# EAGLE design RoPi 2560 0_3 (EAGLE 6.5.0)
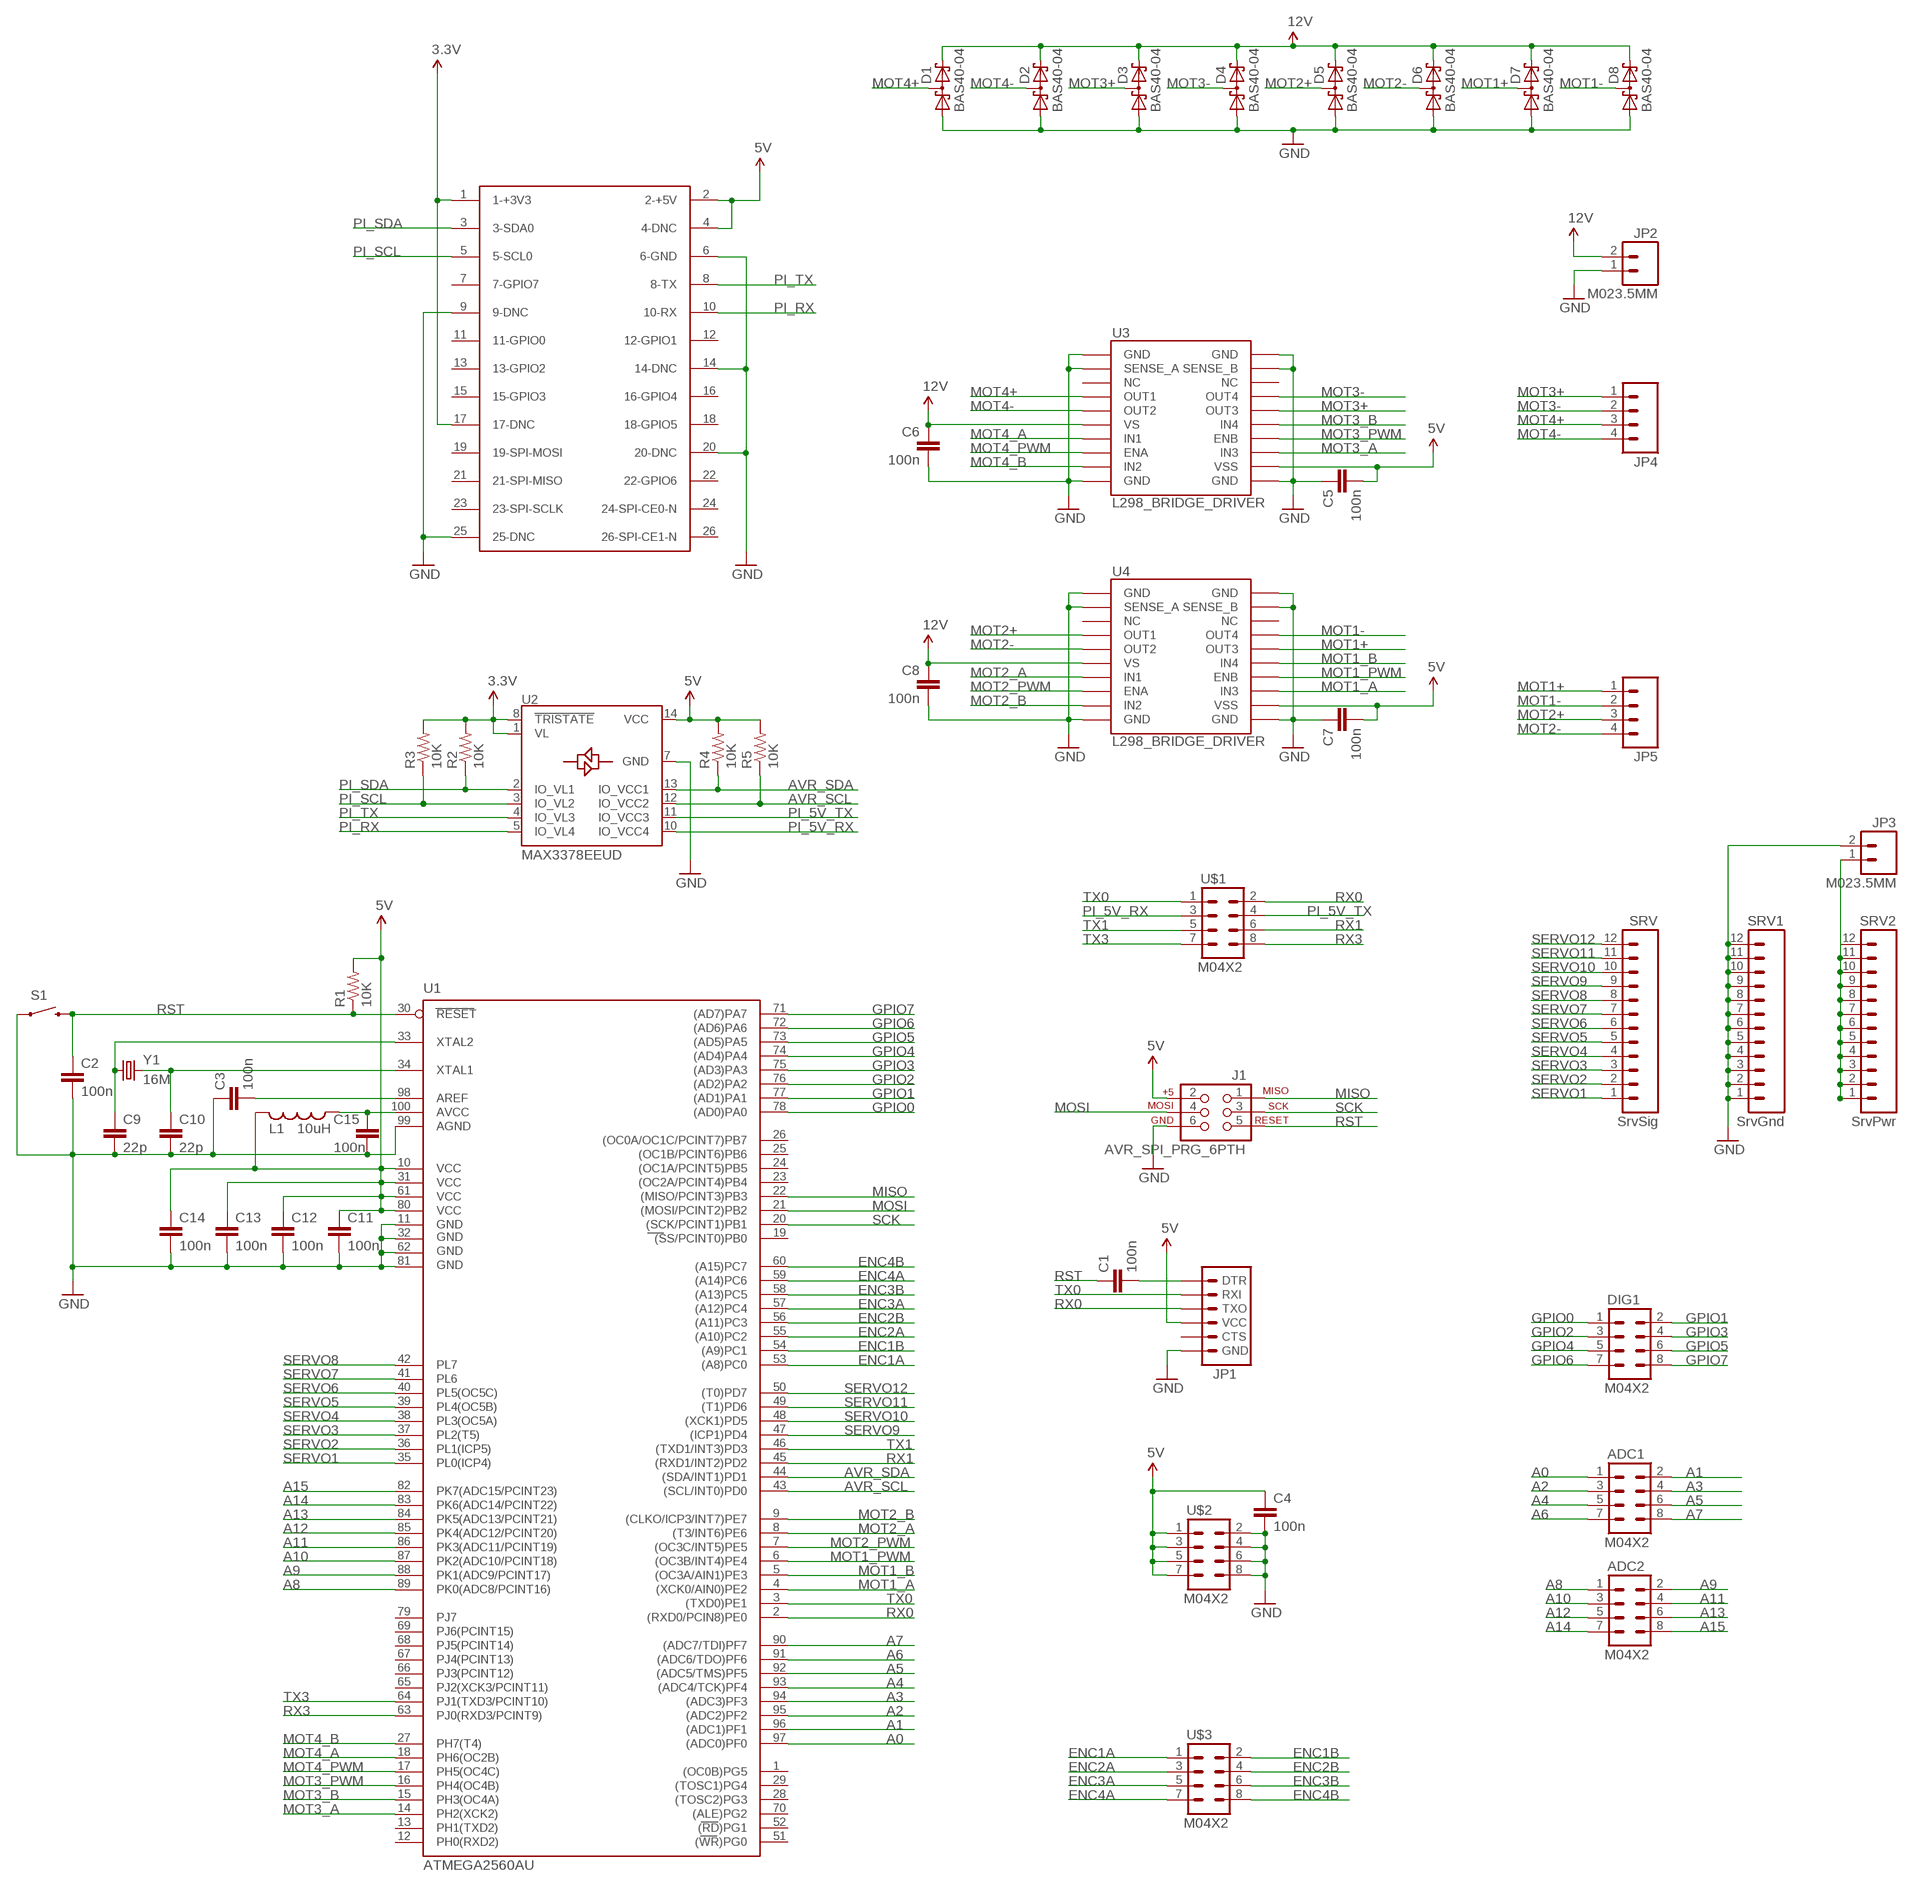
[diagram p0: schematic, sheet 1]

## Parts
ADC1  M04X2  [2X4]
ADC2  M04X2  [2X4]
C1  100n  CAP0603-CAP  [0603-CAP]
C2  100n  CAP0603-CAP  [0603-CAP]
C3  100n  CAP0603-CAP  [0603-CAP]
C4  100n  CAP0603-CAP  [0603-CAP]
C5  100n  CAP0603-CAP  [0603-CAP]
C6  100n  CAP0603-CAP  [0603-CAP]
C7  100n  CAP0603-CAP  [0603-CAP]
C8  100n  CAP0603-CAP  [0603-CAP]
C9  22p  CAP0603-CAP  [0603-CAP]
C10  22p  CAP0603-CAP  [0603-CAP]
C11  100n  CAP0603-CAP  [0603-CAP]
C12  100n  CAP0603-CAP  [0603-CAP]
C13  100n  CAP0603-CAP  [0603-CAP]
C14  100n  CAP0603-CAP  [0603-CAP]
C15  100n  CAP0603-CAP  [0603-CAP]
D1  BAS40-04  [SOT23]
D2  BAS40-04  [SOT23]
D3  BAS40-04  [SOT23]
D4  BAS40-04  [SOT23]
D5  BAS40-04  [SOT23]
D6  BAS40-04  [SOT23]
D7  BAS40-04  [SOT23]
D8  BAS40-04  [SOT23]
DIG1  M04X2  [2X4]
J1  AVR_SPI_PRG_6PTH  [2X3]
JP1  ARDUINO_SERIAL_PROGRAMSMD  [1X06-SMD]
JP2  M023.5MM  [SCREWTERMINAL-3.5MM-2]
JP3  M023.5MM  [SCREWTERMINAL-3.5MM-2]
JP4  M04SCREW  [SCREWTERMINAL-3.5MM-4]
JP5  M04SCREW  [SCREWTERMINAL-3.5MM-4]
L1  10uH  L-US  [R0603]
PI  RASPBERRY-PI  [RASPBERRY-PI]
R1  10K  RESISTOR0603-RES  [0603-RES]
R2  10K  RESISTOR0603-RES  [0603-RES]
R3  10K  RESISTOR0603-RES  [0603-RES]
R4  10K  RESISTOR0603-RES  [0603-RES]
R5  10K  RESISTOR0603-RES  [0603-RES]
S1  SWITCH-MOMENTARY-2SMD-4  [TACTILE_SWITCH_TALL]
SRV  SrvSig  M12PTH  [1X12]
SRV1  SrvGnd  M12PTH  [1X12]
SRV2  SrvPwr  M12PTH  [1X12]
U1  ATMEGA2560AU  [TQFP100]
U2  MAX3378EEUD  [TSSOP14]
U3  L298_BRIDGE_DRIVER  [POWERSO20]
U4  L298_BRIDGE_DRIVER  [POWERSO20]
U$1  M04X2  [2X4]
U$2  M04X2  [2X4]
U$3  M04X2  [2X4]
Y1  16M  CRYSTALSMD  [HC49UP]

## Nets
3.3V: PI.1(1-+3V3) PI.17(17-DNC) R2.2 R3.2 U2.1(VL) U2.8(!TRISTATE)
5V: C4.1 C5.2 C7.2 C11.1 C12.1 C13.1 C14.1 J1.2 JP1.4(VCC) L1.2 PI.2(2-+5V) PI.4(4-DNC) R1.2 R4.2 R5.2 U1.10(VCC) U1.31(VCC1) U1.61(VCC2) U1.80(VCC3) U2.14(VCC) U3.12(VSS) U4.12(VSS) U$2.1 U$2.3 U$2.5 U$2.7
A0: ADC1.1 U1.97((ADC0)PF0)
A1: ADC1.2 U1.96((ADC1)PF1)
A2: ADC1.3 U1.95((ADC2)PF2)
A3: ADC1.4 U1.94((ADC3)PF3)
A4: ADC1.5 U1.93((ADC4/TCK)PF4)
A5: ADC1.6 U1.92((ADC5/TMS)PF5)
A6: ADC1.7 U1.91((ADC6/TDO)PF6)
A7: ADC1.8 U1.90((ADC7/TDI)PF7)
A8: ADC2.1 U1.89(PK0(ADC8/PCINT16))
A9: ADC2.2 U1.88(PK1(ADC9/PCINT17))
A10: ADC2.3 U1.87(PK2(ADC10/PCINT18))
A11: ADC2.4 U1.86(PK3(ADC11/PCINT19))
A12: ADC2.5 U1.85(PK4(ADC12/PCINT20))
A13: ADC2.6 U1.84(PK5(ADC13/PCINT21))
A14: ADC2.7 U1.83(PK6(ADC14/PCINT22))
A15: ADC2.8 U1.82(PK7(ADC15/PCINT23))
AREF: C3.2 U1.98(AREF)
AVR_SCL: R5.1 U1.43((SCL/INT0)PD0) U2.12(IO_VCC2)
AVR_SDA: R4.1 U1.44((SDA/INT1)PD1) U2.13(IO_VCC1)
DTR: C1.2 JP1.1(DTR)
ENC1A: U1.53((A8)PC0) U$3.1
ENC1B: U1.54((A9)PC1) U$3.2
ENC2A: U1.55((A10)PC2) U$3.3
ENC2B: U1.56((A11)PC3) U$3.4
ENC3A: U1.57((A12)PC4) U$3.5
ENC3B: U1.58((A13)PC5) U$3.6
ENC4A: U1.59((A14)PC6) U$3.7
ENC4B: U1.60((A15)PC7) U$3.8
GND: C2.2 C3.1 C4.2 C5.1 C6.2 C7.1 C8.2 C9.2 C10.2 C11.2 C12.2 C13.2 C14.2 C15.2 D1.1(A1) D2.1(A1) D3.1(A1) D4.1(A1) D5.1(A1) D6.1(A1) D7.1(A1) D8.1(A1) J1.6 JP1.6(GND) JP2.1 JP3.2 PI.6(6-GND) PI.9(9-DNC) PI.14(14-DNC) PI.20(20-DNC) PI.25(25-DNC) S1.A2 SRV1.1 SRV1.2 SRV1.3 SRV1.4 SRV1.5 SRV1.6 SRV1.7 SRV1.8 SRV1.9 SRV1.10 SRV1.11 SRV1.12 U1.11(GND) U1.32(GND1) U1.62(GND2) U1.81(GND3) U1.99(AGND) U2.7(GND) U3.1(GND) U3.2(SENSE_A) U3.10(GND) U3.11(GND) U3.19(SENSE_B) U3.20(GND) U4.1(GND) U4.2(SENSE_A) U4.10(GND) U4.11(GND) U4.19(SENSE_B) U4.20(GND) U$2.2 U$2.4 U$2.6 U$2.8
GPIO0: DIG1.1 U1.78((AD0)PA0)
GPIO1: DIG1.2 U1.77((AD1)PA1)
GPIO2: DIG1.3 U1.76((AD2)PA2)
GPIO3: DIG1.4 U1.75((AD3)PA3)
GPIO4: DIG1.5 U1.74((AD4)PA4)
GPIO5: DIG1.6 U1.73((AD5)PA5)
GPIO6: DIG1.7 U1.72((AD6)PA6)
GPIO7: DIG1.8 U1.71((AD7)PA7)
MISO: J1.1 U1.22((MISO/PCINT3)PB3)
MOSI: J1.4 U1.21((MOSI/PCINT2)PB2)
MOT1+: D7.3(C1A2) JP5.1 U4.16(OUT3)
MOT1-: D8.3(C1A2) JP5.2 U4.17(OUT4)
MOT1_A: U1.4((XCK0/AIN0)PE2) U4.13(IN3)
MOT1_B: U1.5((OC3A/AIN1)PE3) U4.15(IN4)
MOT1_PWM: U1.6((OC3B/INT4)PE4) U4.14(ENB)
MOT2+: D5.3(C1A2) JP5.3 U4.4(OUT1)
MOT2-: D6.3(C1A2) JP5.4 U4.5(OUT2)
MOT2_A: U1.8((T3/INT6)PE6) U4.7(IN1)
MOT2_B: U1.9((CLKO/ICP3/INT7)PE7) U4.9(IN2)
MOT2_PWM: U1.7((OC3C/INT5)PE5) U4.8(ENA)
MOT3+: D3.3(C1A2) JP4.1 U3.16(OUT3)
MOT3-: D4.3(C1A2) JP4.2 U3.17(OUT4)
MOT3_A: U1.14(PH2(XCK2)) U3.13(IN3)
MOT3_B: U1.15(PH3(OC4A)) U3.15(IN4)
MOT3_PWM: U1.16(PH4(OC4B)) U3.14(ENB)
MOT4+: D1.3(C1A2) JP4.3 U3.4(OUT1)
MOT4-: D2.3(C1A2) JP4.4 U3.5(OUT2)
MOT4_A: U1.18(PH6(OC2B)) U3.7(IN1)
MOT4_B: U1.27(PH7(T4)) U3.9(IN2)
MOT4_PWM: U1.17(PH5(OC4C)) U3.8(ENA)
N$1: JP3.1 SRV2.1 SRV2.2 SRV2.3 SRV2.4 SRV2.5 SRV2.6 SRV2.7 SRV2.8 SRV2.9 SRV2.10 SRV2.11 SRV2.12
N$2: C15.1 L1.1 U1.100(AVCC)
PI_5V_RX: U2.10(IO_VCC4) U$1.3
PI_5V_TX: U2.11(IO_VCC3) U$1.4
PI_RX: PI.10(10-RX) U2.5(IO_VL4)
PI_SCL: PI.5(5-SCL0) R3.1 U2.3(IO_VL2)
PI_SDA: PI.3(3-SDA0) R2.1 U2.2(IO_VL1)
PI_TX: PI.8(8-TX) U2.4(IO_VL3)
RST: C1.1 C2.1 J1.5 R1.1 S1.B2 U1.30(RESET)
RX0: JP1.3(TXO) U1.2((RXD0/PCIN8)PE0) U$1.2
RX1: U1.45((RXD1/INT2)PD2) U$1.6
RX3: U1.63(PJ0(RXD3/PCINT9)) U$1.8
SCK: J1.3 U1.20((SCK/PCINT1)PB1)
SERVO1: SRV.1 U1.35(PL0(ICP4))
SERVO2: SRV.2 U1.36(PL1(ICP5))
SERVO3: SRV.3 U1.37(PL2(T5))
SERVO4: SRV.4 U1.38(PL3(OC5A))
SERVO5: SRV.5 U1.39(PL4(OC5B))
SERVO6: SRV.6 U1.40(PL5(OC5C))
SERVO7: SRV.7 U1.41(PL6)
SERVO8: SRV.8 U1.42(PL7)
SERVO9: SRV.9 U1.47((ICP1)PD4)
SERVO10: SRV.10 U1.48((XCK1)PD5)
SERVO11: SRV.11 U1.49((T1)PD6)
SERVO12: SRV.12 U1.50((T0)PD7)
TX0: JP1.2(RXI) U1.3((TXD0)PE1) U$1.1
TX1: U1.46((TXD1/INT3)PD3) U$1.5
TX3: U1.64(PJ1(TXD3/PCINT10)) U$1.7
V_BATT: C6.1 C8.1 D1.2(C2) D2.2(C2) D3.2(C2) D4.2(C2) D5.2(C2) D6.2(C2) D7.2(C2) D8.2(C2) JP2.2 U3.6(VS) U4.6(VS) ; supply symbol labelled 12V
XTAL1: C10.1 U1.34(XTAL1) Y1.2
XTAL2: C9.1 U1.33(XTAL2) Y1.1
Unconnected: JP1.5(CTS) PI.7(7-GPIO7) PI.11(11-GPIO0) PI.12(12-GPIO1) PI.13(13-GPIO2) PI.15(15-GPIO3) PI.16(16-GPIO4) PI.18(18-GPIO5) PI.19(19-SPI-MOSI) PI.21(21-SPI-MISO) PI.22(22-GPIO6) PI.23(23-SPI-SCLK) PI.24(24-SPI-CE0-N) PI.26(26-SPI-CE1-N) U1.1((OC0B)PG5) U1.12(PH0(RXD2)) U1.13(PH1(TXD2)) U1.19((SS/PCINT0)PB0) U1.23((OC2A/PCINT4)PB4) U1.24((OC1A/PCINT5)PB5) U1.25((OC1B/PCINT6)PB6) U1.26((OC0A/OC1C/PCINT7)PB7) U1.28((TOSC2)PG3) U1.29((TOSC1)PG4) U1.51((WR)PG0) U1.52((RD)PG1) U1.65(PJ2(XCK3/PCINT11)) U1.66(PJ3(PCINT12)) U1.67(PJ4(PCINT13)) U1.68(PJ5(PCINT14)) U1.69(PJ6(PCINT15)) U1.70((ALE)PG2) U1.79(PJ7) U3.3(NC) U3.18(NC) U4.3(NC) U4.18(NC)

## Library data of the parts
ADC1 ADC2 DIG1 U$1-U$3 = SparkFun-Connectors:M04X2: .1" header, two rows of four.
C1-C15 = SparkFun-Passives:CAP: Capacitor Standard 0603 ceramic capacitor, and 0.1" leaded capacitor.
D1-D8 = diode:BAS40-04: Silicon Schottky Diodes General-purpose diode for high-speed switching
J1 = SparkFun-Connectors:AVR_SPI_PRG_6: AVR ISP 6 Pin This is the reduced ISP connector for AVR programming. Common on Arduino. This footprint will take up less PCB space and can be used with a 10-pin to 6-pin adapter such as SKU: BOB-08508
JP1 = SparkFun-Connectors:ARDUINO_SERIAL_PROGRAM: FTDI connector footprints
JP2 JP3 = SparkFun-Connectors:M02: Standard 2-pin 0.1" header. Use with - straight break away headers ( PRT-00116) - right angle break away headers (PRT-00553) - swiss pins (PRT-00743) - machine pins (PRT-00117) - female headers (PRT-00115) Molex polarized connector foot print use with: PRT-08233 with associated crimp pins and housings. 2.54_SCREWTERM for use with PRT-10571. 3.5mm Screw Terminal footprints for PRT-08084 5mm Screw Terminal footprints for use with PRT-08433
JP4 JP5 = SparkFun-Connectors:M04: Header 4 Standard 4-pin 0.1" header. Use with straight break away headers (SKU : PRT-00116), right angle break away headers (PRT-00553), swiss pins (PRT-00743), machine pins (PRT-00117), and female headers (PRT-00115). Molex polarized connector foot print use with SKU : PRT-08231 with associated crimp pins and housings. 1MM SMD Version SKU: PRT-10208
L1 = dab5267:L-US: INDUCTOR, American symbol
PI = RaspberryPi:RASPBERRY-PI: Raspberry Pi Board <http://www.raspberrypi.org/> Jacques Lagnel V1.0 (beta) 2012 Board dimension: Forum 3D model <http://www.raspberrypi.org/forum/general-discussion/mechanical-profile-3d-models?value=3d%20model&type=1&include=1&search=1&ret=all> The GPIO Connector (P1): http://elinux.org/RPi_Low-level_peripherals
R1-R5 = SparkFun-Passives:RESISTOR: Resistor Basic schematic elements and footprints for 0603, 1206, and PTH resistors.
S1 = SparkFun-Electromechanical:SWITCH-MOMENTARY-2: Various NO switches- pushbuttons, reed, etc
SRV SRV1 SRV2 = SparkFun-Connectors:M12: Header 12 Standard 12-pin 0.1" header. Use with straight break away headers (SKU : PRT-00116), right angle break away headers (PRT-00553), swiss pins (PRT-00743), machine pins (PRT-00117), and female headers (PRT-00115).
U1 = SparkFun-DigitalIC:ATMEGA2560: Atmel 100-pin 8-bit uC 64/128/256 Kbytes FLASH 4 Kbytes EEPROM 8 Kbytes SRAM 86 General Purpose I/O pins 12-channels16-bit PWM 4 x Serial USARTs 16-channels 10-bit A/D
U2 = max3378e:MAX3378EEUD: ±15kV ESD-Protected, 1µA, 16Mbps, Dual/Quad Low-Voltage Level Translators in UCSP
U3 U4 = SparkFun-PowerIC:L298_BRIDGE_DRIVER: Full-bridge power driver IC
Y1 = SparkFun-FreqCtrl:CRYSTAL: Various standard crystals. Proven footprints. Spark Fun Electronics SKU : COM-00534

## Board
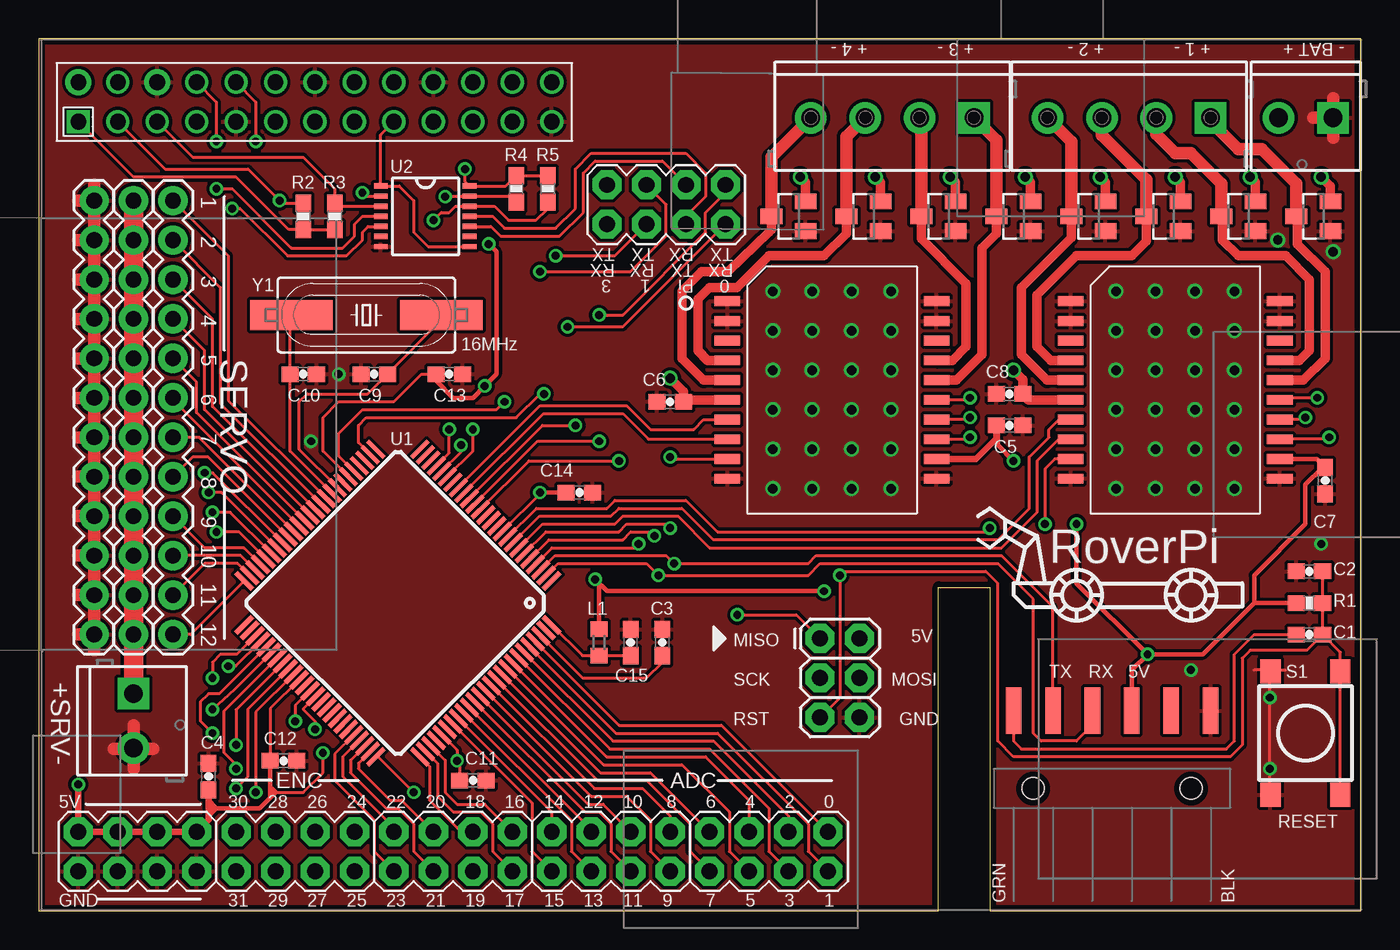
[diagram p1: board, top side]
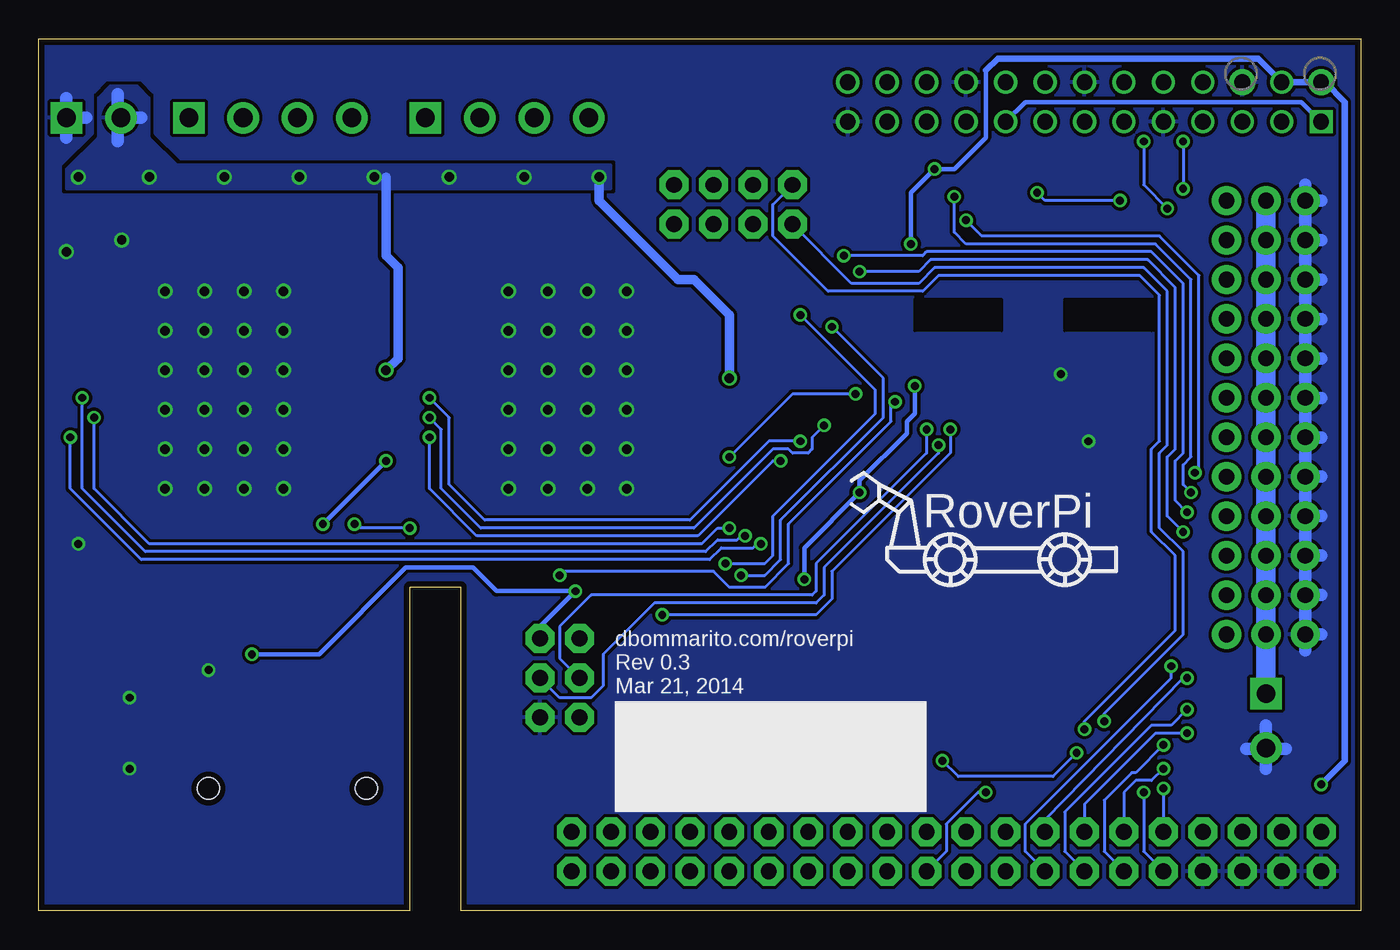
[diagram p2: board, bottom side, seen from below]

Size 85.09 x 56.13 mm. Coordinates in mm from the lower left corner, seen from the top.
Outline: 0,0 57.91,0 57.91,20.83 61.21,20.83 61.21,0 85.09,0 85.09,56.13 0,56.13 0,0
Copper layers (1*16): Top 0.0356mm / dielectric 1.5011mm / Bottom 0.0356mm
Design rules "OSHPark *": minimum track width 6mil, minimum drill 13mil, track to track 8mil, track to pad 8mil, pad to pad 8mil, via to via 8mil, smd to smd 8mil, copper to edge 15mil, drill to drill 6mil, minimum pad ring 7mil, minimum via ring 7mil, stop-mask expansion 3mil, vias tented up to drill 30mil, thermal gap 8mil

### Footprints (pad centres in the part's own frame; a part is rotated, then mirrored left to right if it is on the bottom)
2X4 = drill 1.016 pad 1.88 octagon: 1 -3.81,-1.27; 2 -3.81,1.27; 3 -1.27,-1.27; 4 -1.27,1.27; 5 1.27,-1.27; 6 1.27,1.27; 7 3.81,-1.27; 8 3.81,1.27
0603-CAP = smd 1.1 x 1: 1 -0.85,0; 2 0.85,0
SOT23 = smd 1 x 1.4: 1 -0.95,-1.1; 2 0.95,-1.1; 3 0,1.1
2X3 = drill 1.016 pad 1.88 octagon: 1 0,0; 2 0,2.54; 3 2.54,0; 4 2.54,2.54; 5 5.08,0; 6 5.08,2.54
1X06-SMD = smd 1 x 3: 1 -6.35,5; 2 -3.81,5; 3 -1.27,5; 4 1.27,5; 5 3.81,5; 6 6.35,5 | hole 1.4: -5.08,0; 5.08,0
SCREWTERMINAL-3.5MM-2 = drill 1.2 pad 2.032 square: 1 0,0 | drill 1.2 pad 2.032: 2 3.5,0
SCREWTERMINAL-3.5MM-4 = drill 1.2 pad 2.032 square: 1 0,0 | drill 1.2 pad 2.032: 2 3.5,0; 3 7,0; 4 10.5,0
R0603 = smd 1 x 1.1: 1 -0.85,0; 2 0.85,0
RASPBERRY-PI = drill 1 square: 1 0,0 | drill 1 pad 1.676: 2 0,2.54; 6 5.08,2.54 | drill 1: 3 2.54,0; 4 2.54,2.54; 5 5.08,0; 7 7.62,0; 8 7.62,2.54; 9 10.16,0; 10 10.16,2.54; 11 12.7,0; 12 12.7,2.54; 13 15.24,0; 14 15.24,2.54; 15 17.78,0; 16 17.78,2.54; 17 20.32,0; 18 20.32,2.54; 19 22.86,0; 20 22.86,2.54; 21 25.4,0; 22 25.4,2.54; 23 27.94,0; 24 27.94,2.54; 25 30.48,0; 26 30.48,2.54
0603-RES = smd 1.1 x 1: 1 -0.85,0; 2 0.85,0
TACTILE_SWITCH_TALL = smd 1.55 x 1.3: A1 -3.975,-2.25; A2 3.975,-2.25; B1 -3.975,2.25; B2 3.975,2.25
1X12 = drill 1.016 pad 1.88: 1 0,0; 2 2.54,0; 3 5.08,0; 4 7.62,0; 5 10.16,0; 6 12.7,0; 7 15.24,0; 8 17.78,0; 9 20.32,0; 10 22.86,0; 11 25.4,0; 12 27.94,0
TQFP100 = smd 1.5 x 0.3: 1 -8,6; 2 -8,5.5; 3 -8,5; 4 -8,4.5; 5 -8,4; 6 -8,3.5; 7 -8,3; 8 -8,2.5; 9 -8,2; 10 -8,1.5; 11 -8,1; 12 -8,0.5; 13 -8,0; 14 -8,-0.5; 15 -8,-1; 16 -8,-1.5; 17 -8,-2; 18 -8,-2.5; 19 -8,-3; 20 -8,-3.5; 21 -8,-4; 22 -8,-4.5; 23 -8,-5; 24 -8,-5.5; 25 -8,-6; 51 8,-6; 52 8,-5.5; 53 8,-5; 54 8,-4.5; 55 8,-4; 56 8,-3.5; 57 8,-3; 58 8,-2.5; 59 8,-2; 60 8,-1.5; 61 8,-1; 62 8,-0.5; 63 8,0; 64 8,0.5; 65 8,1; 66 8,1.5; 67 8,2; 68 8,2.5; 69 8,3; 70 8,3.5; 71 8,4; 72 8,4.5; 73 8,5; 74 8,5.5; 75 8,6 | smd 0.3 x 1.5: 26 -6,-8; 27 -5.5,-8; 28 -5,-8; 29 -4.5,-8; 30 -4,-8; 31 -3.5,-8; 32 -3,-8; 33 -2.5,-8; 34 -2,-8; 35 -1.5,-8; 36 -1,-8; 37 -0.5,-8; 38 0,-8; 39 0.5,-8; 40 1,-8; 41 1.5,-8; 42 2,-8; 43 2.5,-8; 44 3,-8; 45 3.5,-8; 46 4,-8; 47 4.5,-8; 48 5,-8; 49 5.5,-8; 50 6,-8; 76 6,8; 77 5.5,8; 78 5,8; 79 4.5,8; 80 4,8; 81 3.5,8; 82 3,8; 83 2.5,8; 84 2,8; 85 1.5,8; 86 1,8; 87 0.5,8; 88 0,8; 89 -0.5,8; 90 -1,8; 91 -1.5,8; 92 -2,8; 93 -2.5,8; 94 -3,8; 95 -3.5,8; 96 -4,8; 97 -4.5,8; 98 -5,8; 99 -5.5,8; 100 -6,8
TSSOP14 = smd 0.9 x 0.35: 1 -2.875,1.95; 2 -2.875,1.3; 3 -2.875,0.65; 4 -2.875,0; 5 -2.875,-0.65; 6 -2.875,-1.3; 7 -2.875,-1.95; 8 2.825,-1.95; 9 2.825,-1.3; 10 2.825,-0.65; 11 2.825,0; 12 2.825,0.65; 13 2.825,1.3; 14 2.825,1.95
POWERSO20 = smd 1.651 x 0.635: 1 -6.731,5.715; 2 -6.731,4.445; 3 -6.731,3.175; 4 -6.731,1.905; 5 -6.731,0.635; 6 -6.731,-0.635; 7 -6.731,-1.905; 8 -6.731,-3.175; 9 -6.731,-4.445; 10 -6.731,-5.715; 11 6.731,-5.715; 12 6.731,-4.445; 13 6.731,-3.175; 14 6.731,-1.905; 15 6.731,-0.635; 16 6.731,0.635; 17 6.731,1.905; 18 6.731,3.175; 19 6.731,4.445; 20 6.731,5.715
HC49UP = smd 5.334 x 1.93: 1 -4.826,0; 2 4.826,0

### Placement (x,y rotation side)
ADC1  46.99,3.81 180 top
ADC2  36.83,3.81 180 top
C1  81.79,17.78 180 top
C2  81.79,21.84 180 top
C3  40.13,17.27 270 top
C4  10.92,8.64 90 top
C5  62.48,31.24 180 top
C6  40.64,32.77 180 top
C7  82.8,27.69 90 top
C8  62.48,33.27 180 top
C9  21.59,34.54 180 top
C10  17.02,34.54 0 top
C11  27.94,8.38 0 top
C12  15.75,9.65 0 top
C13  26.42,34.54 0 top
C14  34.8,26.92 0 top
C15  38.1,17.27 90 top
D1  53.09,44.7 90 top
D2  48.26,44.7 90 top
D3  62.74,44.7 90 top
D4  57.91,44.7 90 top
D5  72.39,44.7 90 top
D6  67.56,44.7 90 top
D7  82.04,44.7 90 top
D8  77.22,44.7 90 top
DIG1  26.67,3.81 180 top
J1  50.29,17.53 270 top
JP1  69.09,7.87 0 top
JP2  83.31,51.05 180 top
JP3  6.1,13.97 270 top
JP4  60.2,51.05 180 top
JP5  75.44,51.05 180 top
L1  36.07,17.27 90 top
PI  2.54,50.8 0 top
R1  81.79,19.81 180 top
R2  17.02,44.7 270 top
R3  19.05,44.7 270 top
R4  30.73,46.48 90 top
R5  32.77,46.48 90 top
S1  81.53,11.43 270 top
SRV  8.64,45.72 270 top
SRV1  3.56,45.72 270 top
SRV2  6.1,45.72 270 top
U1  23.11,19.81 225 top
U2  24.89,44.7 0 top
U3  51.05,33.53 0 top
U4  73.15,33.53 0 top
U$1  40.39,45.47 180 top
U$2  6.35,3.81 180 top
U$3  16.51,3.81 180 top
Y1  21.08,38.35 180 top

### Tracks (layer width: path | path; a pad name or v marks a point on that pad's centre or on a via)
3.3V
  Top 0.203: PI.17 22.02,49.96 U2.1 23.2,46.65 24.13,45.72 24.13,43.69 25.06,42.75 U2.8 | PI.1 6.1,47.24 12.7,47.24 16.09,43.85 R2.2 R3.2
  Bottom 0.305: PI.1 3.81,52.07 21.59,52.07 PI.17
5V  (via drill 0.51)
  Top 0.203: U1.61 14.9,13.01 C12.1 | U1.31 18.29,29.59 18.29,31.75 19.3,32.77 22.86,32.77 24.64,34.54 C13.1 | U1.80 26.92,10.35 v26.92,9.65 27.09,9.49 C11.1 | U1.10 32.35,26.92 32.77,26.92 | R5.2 R4.2 30.06,46.65 U2.14 27.43,46.94 v27.43,47.75 | 15.24,7.62 17.02,7.62 18.29,8.89 v18.29,10.16
  Top 0.305: C12.1 14.9,7.28 | 14.9,7.28 14.22,6.6 11.43,6.6 | 11.43,6.6 10.92,6.1 | JP1.4 70.36,15.49 v71.37,16.51 | v71.37,16.51 74.93,16.51 78.23,19.81 | 78.23,19.81 R1.2 | 78.23,19.81 78.23,21.59 81.53,24.89 81.53,27.43 82.64,28.54 | U4.12 82.26,29.08 C7.2 | 10.92,6.6 11.43,6.6 | 11.43,6.6 10.92,7.11 | v28.96,42.93 29.46,42.42 29.46,34.54 v28.7,33.78 27.94,33.02 26.67,33.02 25.57,34.12 C13.1 | v32.26,26.92 32.77,26.92 C14.1 | L1.2 36.07,21.08 v35.81,21.34 36.58,20.57 v50.55,20.57 | v71.37,16.51 66.8,21.08 v66.8,24.89 | v62.74,28.96 61.72,29.97 61.72,31.15 C5.2 | 14.9,7.28 15.24,7.62 | 15.24,7.62 14.99,7.87 | 14.99,7.62 15.24,7.62
  Top 0.406: 10.67,7.71 C4.1 10.92,7.11 10.92,6.6 10.92,6.1 10.92,5.84 U$2.1 U$2.3 U$2.5 U$2.7 v2.54,8.13 | U3.12 60.33,29.08 61.63,30.39 C5.2 | C7.2 82.64,28.54
  Bottom 0.203: v18.29,10.16 19.81,8.64 25.91,8.64 v26.92,9.65
  Bottom 0.305: 24.13,54.1 24.13,49.78 26.16,47.75 v27.43,47.75 28.96,46.23 v28.96,42.93 | v28.7,33.78 28.7,32 29.21,31.5 29.21,30.73 32.26,27.69 v32.26,26.92 35.81,23.37 v35.81,21.34 | J1.2 52.83,18.29 v50.55,20.57 55.63,20.57 57.15,22.1 61.47,22.1 67.06,16.51 v71.37,16.51 | v66.8,24.89 v62.74,28.96
  Bottom 0.406: v2.54,8.13 1.02,9.65 1.02,52.07 2.29,53.34 PI.2 PI.4 6.6,54.86 23.37,54.86 24.13,54.1
A0
  Top 0.203: U1.97 37.35,11.94 43.94,11.94 ADC1.1
A1
  Top 0.203: U1.96 37.15,11.43 43.69,11.43 49.53,5.59 49.53,3.81 ADC1.2
A2
  Top 0.203: U1.95 36.95,10.92 43.43,10.92 48.26,6.1 ADC1.3
A3
  Top 0.203: U1.94 36.76,10.41 43.18,10.41 46.99,6.6 46.99,3.81 ADC1.4
A4
  Top 0.203: U1.93 36.56,9.91 42.93,9.91 45.72,7.11 ADC1.5
A5
  Top 0.203: U1.92 36.36,9.4 41.4,9.4 44.45,6.35 44.45,3.81 ADC1.6
A6
  Top 0.203: U1.91 36.16,8.89 39.37,8.89 ADC1.7
A7
  Top 0.203: U1.90 35.96,8.38 39.12,8.38 41.91,5.59 41.91,3.81 ADC1.8
A8
  Top 0.203: U1.89 35.76,7.87 38.86,7.87 40.64,6.1 ADC2.1
A9
  Top 0.203: U1.88 35.56,7.37 37.85,7.37 39.37,5.84 39.37,3.81 ADC2.2
A10
  Top 0.203: U1.87 35.36,6.86 36.32,6.86 ADC2.3
A11
  Top 0.203: U1.86 35.16,6.35 36.07,6.35 36.83,5.59 36.83,3.81 ADC2.4
A12
  Top 0.203: U1.85 35.56,5.25 ADC2.5
A13
  Top 0.203: U1.84 34.29,5.81 34.29,3.81 ADC2.6
A14
  Top 0.203: U1.83 33.02,6.37 ADC2.7
A15
  Top 0.203: U1.82 31.75,6.93 31.75,3.81 ADC2.8
AREF
  Top 0.203: U1.98 35.01,14.99 39.12,14.99 40.13,16 C3.2
AVR_SCL  (via drill 0.51)
  Top 0.203: U1.43 11.2,28.19 v10.67,28.19 | v25.4,44.45 25.91,44.96 26.42,44.96 26.81,45.35 U2.12 29.32,45.35 30.23,44.45 32,44.45 32.77,45.21 R5.1
  Bottom 0.203: v10.67,28.19 10.41,28.45 10.41,40.89 12.95,43.43 24.38,43.43 v25.4,44.45
AVR_SDA  (via drill 0.51)
  Top 0.203: U1.44 11.76,26.92 v10.92,26.92 | v26.16,45.97 26.19,46 U2.13 30.36,46 R4.1
  Bottom 0.203: v10.92,26.92 11.43,27.43 11.43,28.7 10.92,29.21 10.92,40.64 13.21,42.93 25.4,42.93 26.16,43.69 v26.16,45.97
DTR
  Top 0.203: JP1.1 62.74,10.92 63.25,10.41 76.45,10.41 76.96,10.92 76.96,16.51 78.23,17.78 C1.2
ENC1A  (via drill 0.51)
  Top 0.203: U1.53 12.74,16.51 11.68,16.51 11.18,16 v11.18,14.99
  Bottom 0.203: U$3.1 20.32,5.84 11.43,14.99 v11.18,14.99
ENC1B  (via drill 0.51)
  Top 0.203: v12.19,15.75 12.69,15.75 U1.54
  Bottom 0.203: U$3.2 21.59,3.81 21.59,5.59 12.19,14.99 v12.19,15.75
ENC2A  (via drill 0.51)
  Top 0.203: U1.55 11.62,13.97 10.92,13.97 10.41,13.46 10.41,12.19 v11.18,11.43
  Bottom 0.203: v11.18,11.43 13.21,11.43 17.78,6.86 U$3.3
ENC2B  (via drill 0.51)
  Top 0.203: U1.56 12.58,14.22 v11.18,12.95
  Bottom 0.203: v11.18,12.95 12.19,11.94 13.46,11.94 19.05,6.35 19.05,3.81 U$3.4
ENC3A  (via drill 0.51)
  Top 0.203: U1.57 11.94,12.88 11.94,10.16 12.7,9.4 v12.7,9.14
  Bottom 0.203: v12.7,9.14 13.46,8.38 14.48,8.38 15.24,7.62 U$3.5
ENC3B  (via drill 0.51)
  Top 0.203: U1.58 12.7,12.93 v12.7,10.67
  Bottom 0.203: U$3.6 16.51,3.81 16.51,7.11 14.73,8.89 14.48,8.89 v12.7,10.67
ENC4A  (via drill 0.51)
  Top 0.203: v12.7,7.87 13.46,8.64 13.46,12.99 U1.59
  Bottom 0.203: v12.7,7.87 U$3.7
ENC4B  (via drill 0.51)
  Top 0.203: U1.60 13.97,12.79 v13.97,7.62
  Bottom 0.203: v13.97,7.62 13.97,3.81 U$3.8
GND  (via drill 0.51, 0.61)
  Top 0.203: 79.25,7.37 v79.25,9.14 v79.25,13.72 79.25,15.49 | 79.25,15.49 80.26,15.49 | 79.25,15.49 78.23,15.49
  Top 0.813: 83.31,52.32 JP2.1 | JP2.1 83.31,49.78 | JP2.1 82.04,51.05 | 3.56,46.74 SRV1.1 | SRV1.1 SRV1.2 | SRV1.2 SRV1.3 | SRV1.3 SRV1.4 | SRV1.4 SRV1.5 | SRV1.5 SRV1.6 | SRV1.6 SRV1.7 | SRV1.7 SRV1.8 | SRV1.8 SRV1.9 | SRV1.9 SRV1.10 | SRV1.10 SRV1.11 | SRV1.11 SRV1.12 | SRV1.12 3.56,16.76 | SRV1.12 2.54,17.78 | SRV1.11 2.54,20.32 | SRV1.10 2.54,22.86 | SRV1.9 2.54,25.4 | SRV1.8 2.54,27.94 | SRV1.7 2.54,30.48 | SRV1.6 2.54,33.02 | SRV1.5 2.54,35.56 | SRV1.4 2.54,38.1 | SRV1.3 2.54,40.64 | SRV1.2 2.54,43.18 | SRV1.1 2.54,45.72 | 7.37,10.41 4.83,10.41 | 6.1,11.94 6.1,9.14
  Bottom 0.813: 83.31,52.32 JP2.1 | 83.31,49.78 JP2.1 | JP2.1 82.04,51.05 | 3.56,46.74 SRV1.1 | SRV1.1 SRV1.2 | SRV1.2 SRV1.3 | SRV1.3 SRV1.4 | SRV1.4 SRV1.5 | SRV1.5 SRV1.6 | SRV1.6 SRV1.7 | SRV1.7 SRV1.8 | SRV1.8 SRV1.9 | SRV1.9 SRV1.10 | SRV1.10 SRV1.11 | SRV1.11 SRV1.12 | SRV1.12 3.56,16.76 | SRV1.1 2.54,45.72 | SRV1.2 2.54,43.18 | SRV1.3 2.54,40.64 | SRV1.4 2.54,38.1 | SRV1.5 2.54,35.56 | SRV1.6 2.54,33.02 | SRV1.7 2.54,30.48 | SRV1.8 2.54,27.94 | SRV1.9 2.54,25.4 | SRV1.10 2.54,22.86 | SRV1.12 2.54,17.78 | SRV1.11 2.54,20.32 | 6.1,11.94 6.1,9.14 | 7.37,10.41 4.83,10.41
  other vias: 79.76,43.18 47.24,39.88 49.78,39.88 52.32,39.88 54.86,39.88 54.86,37.34 47.24,37.34 49.78,37.34 52.32,37.34 47.24,34.8 49.78,34.8 52.32,34.8 54.86,34.8 54.86,32.26 52.32,32.26 47.24,32.26 47.24,29.72 49.78,29.72 52.32,29.72 54.86,29.72 54.86,27.18 52.32,27.18 49.78,27.18 47.24,27.18 49.78,32.26 69.34,39.88 71.88,39.88 74.42,39.88 76.96,39.88 76.96,37.34 69.34,37.34 71.88,37.34 74.42,37.34 69.34,34.8 71.88,34.8 74.42,34.8 76.96,34.8 76.96,32.26 74.42,32.26 69.34,32.26 69.34,29.72 71.88,29.72 74.42,29.72 76.96,29.72 76.96,27.18 74.42,27.18 71.88,27.18 69.34,27.18 71.88,32.26 83.31,42.42 74.17,15.49 17.53,30.23 19.3,34.54 82.55,23.62
  pour Bottom (rank 6): -0.25,56.39 -0.25,-0.25 58.17,-0.25 58.17,20.57 60.96,20.57 60.96,-0.25 85.34,-0.25 85.34,56.39
  pour Top (rank 6): -0.25,56.39 -0.25,-0.25 58.17,-0.25 58.17,20.57 60.96,20.57 60.96,-0.25 85.34,-0.25 85.34,56.39
  cutout Bottom (rank 6): 13.46,39.37 13.46,37.34 19.05,37.34 19.05,39.37
  cutout Bottom: 23.11,39.37 23.11,37.34 28.7,37.34 28.7,39.37
GPIO0
  Top 0.203: U1.78 26.16,9.69 26.16,7.62 26.92,6.86 28.7,6.86 DIG1.1
GPIO1
  Top 0.203: U1.77 25.65,9.49 25.65,7.37 26.67,6.35 28.45,6.35 29.21,5.59 29.21,3.81 DIG1.2
GPIO2
  Top 0.203: U1.76 25.15,9.29 25.15,7.11 27.18,5.08 DIG1.3
GPIO3  (via drill 0.51)
  Top 0.203: U1.75 21.84,9.91 v24.13,7.62
  Bottom 0.203: v24.13,7.62 24.64,7.62 26.67,5.59 26.67,3.81 DIG1.4
GPIO4
  Top 0.203: U1.74 20.57,9.49 20.57,9.14 22.61,7.11 23.37,7.11 DIG1.5
GPIO5
  Top 0.203: U1.73 20.07,9.69 20.07,8.89 22.35,6.6 23.11,6.6 24.13,5.59 24.13,3.81 DIG1.6
GPIO6
  Top 0.203: U1.72 19.57,9.91 19.56,9.91 19.56,8.64 22.86,5.33 DIG1.7
GPIO7
  Top 0.203: U1.71 19.05,10.09 19.05,8.38 21.59,5.84 21.59,3.81 DIG1.8
MISO  (via drill 0.51)
  Top 0.203: U1.22 26.42,29.48 v26.42,30.99 | v44.96,19.05 48.77,19.05 J1.1
  Bottom 0.203: v26.42,30.99 26.42,29.46 34.04,21.84 34.04,20.07 35.05,19.05 v44.96,19.05
MOSI  (via drill 0.51)
  Top 0.203: U1.21 27.18,29.53 v27.18,29.97
  Bottom 0.203: v27.18,29.97 27.18,29.46 34.54,22.1 34.54,20.32 35.05,19.81 45.47,19.81 48.77,16.51 48.77,14.48 49.53,13.72 51.56,13.72 J1.4
MOT1+
  Top 0.61: U4.16 81.41,34.16 82.8,35.56 82.8,41.15 81.03,42.93 81.03,44.62 D7.3
  Top 0.813: D7.3 80.94,46.82 78.74,49.02 77.22,49.02 75.44,50.8 JP5.1
MOT1-
  Top 0.61: U4.17 81.15,35.43 81.79,36.07 81.79,40.64 80.26,42.16 77.22,42.16 76.2,43.18 76.2,44.62 D8.3
  Top 0.813: D8.3 76.12,46.82 74.17,48.77 73.15,48.77 71.94,49.98 JP5.2
MOT1_A  (via drill 0.51)
  Top 0.203: U1.4 33.03,23.37 38.35,23.37 v38.61,23.62 | v83.06,30.48 82.93,30.35 U4.13
  Bottom 0.203: v83.06,30.48 83.06,27.18 78.49,22.61 41.91,22.61 41.15,23.37 39.12,23.37 38.86,23.62 v38.61,23.62
MOT1_B  (via drill 0.51)
  Top 0.203: U1.5 32.84,23.88 37.59,23.88 38.1,24.38 39.37,24.38 v39.62,24.13 | v82.3,33.02 80.01,33.02 U4.15
  Bottom 0.203: v82.3,33.02 82.3,27.18 78.23,23.11 42.16,23.11 41.4,23.88 40.13,23.88 39.88,24.13 v39.62,24.13
MOT1_PWM  (via drill 0.51)
  Top 0.203: U1.6 32.64,24.38 37.34,24.38 37.85,24.89 40.39,24.89 v40.64,24.64 | v81.53,31.75 81.41,31.62 U4.14
  Bottom 0.203: v81.53,31.75 81.53,27.18 77.98,23.62 42.42,23.62 41.4,24.64 v40.64,24.64
MOT2+
  Top 0.61: U4.4 65.15,35.43 64.26,36.32 64.26,39.62 66.8,42.16 70.36,42.16 71.29,43.1 D5.3
  Top 0.813: D5.3 71.29,47.07 68.44,49.93 JP5.3
MOT2-
  Top 0.61: U4.5 64.9,34.16 63.25,35.81 63.25,40.13 66.46,43.35 D6.3
  Top 0.813: D6.3 66.46,47.58 66.46,49.53 JP5.4
MOT2_A
  Top 0.203: U1.8 32.24,25.4 36.83,25.4 37.34,25.91 41.4,25.91 43.43,23.88 61.72,23.88 63.75,25.91 63.75,29.21 65.02,30.48 65.02,30.99 65.66,31.62 U4.7
MOT2_B  (via drill 0.51)
  Top 0.203: U4.9 65.41,29.08 64.77,28.45 v64.77,24.89 | U1.9 32.04,25.91 36.58,25.91 37.08,26.42 41.66,26.42 43.69,24.38 60.96,24.38 v61.21,24.64
  Bottom 0.203: v61.21,24.64 64.52,24.64 v64.77,24.89
MOT2_PWM
  Top 0.203: U4.8 65.66,30.35 64.26,28.96 64.26,25.65 61.98,23.37 43.18,23.37 41.15,25.4 37.59,25.4 37.08,24.89 32.44,24.89 U1.7
MOT3+
  Top 0.61: U3.16 59.05,34.16 60.71,35.81 60.71,42.67 61.64,43.6 D3.3
  Top 0.813: D3.3 61.64,49.61 JP4.1
MOT3-
  Top 0.61: U3.17 58.8,35.43 59.69,36.32 59.69,40.39 56.81,43.26 D4.3
  Top 0.813: D4.3 56.81,50.94 JP4.2
MOT3_A  (via drill 0.51)
  Top 0.203: U3.13 59.82,30.35 v59.94,30.48 | U1.14 31.55,28.96 v37.34,28.96
  Bottom 0.203: v37.34,28.96 37.85,28.96 42.67,24.13 56.9,24.13 59.94,27.18 v59.94,30.48 59.94,29.97
MOT3_B  (via drill 0.51)
  Top 0.203: U1.15 32.11,30.23 v36.07,30.23 | v59.94,33.02 59.82,32.89 U3.15
  Bottom 0.203: v36.07,30.23 38.1,30.23 43.18,25.15 56.39,25.15 58.67,27.43 58.67,31.75 v59.94,33.02
MOT3_PWM  (via drill 0.51)
  Top 0.203: v59.94,31.75 59.82,31.62 U3.14 | U1.16 32.42,31.24 v34.54,31.24
  Bottom 0.203: v59.94,31.75 59.18,30.99 59.18,27.18 56.64,24.64 42.93,24.64 37.85,29.72 36.83,29.72 36.58,29.46 35.56,29.46 35.31,29.72 35.31,30.48 v34.54,31.24
MOT4+
  Top 0.61: U3.4 43.05,35.43 42.42,36.07 42.42,39.37 43.18,40.13 44.96,40.13 46.99,42.16 50.55,42.16 51.99,43.6 D1.3
  Top 0.813: D1.3 51.99,49.84 JP4.3
MOT4-
  Top 0.61: U3.5 42.8,34.16 41.4,35.56 41.4,39.88 42.67,41.15 44.37,41.15 46.99,43.69 47.16,43.86 D2.3
  Top 0.813: D2.3 47.16,48.52 JP4.4
MOT4_A
  Top 0.203: U3.7 42.8,31.62 42.16,30.99 39.37,30.99 37.85,32.51 32.28,32.51 U1.18
MOT4_B  (via drill 0.51)
  Top 0.203: U1.27 20.57,30.13 20.57,31.24 21.08,31.75 30.73,31.75 32.26,33.27 v32.51,33.27 | v40.64,29.21 40.77,29.08 U3.9
  Bottom 0.203: v32.51,33.27 36.58,33.27 v40.64,29.21
MOT4_PWM
  Top 0.203: U3.8 39.24,30.35 37.59,32 32.48,32 U1.17
N$1
  Top 1.27: JP3.1 SRV2.12 SRV2.11 SRV2.10 SRV2.9 SRV2.8 SRV2.7 SRV2.6 SRV2.5 SRV2.4 SRV2.3 SRV2.2 SRV2.1
  Bottom 1.27: JP3.1 SRV2.1
N$2
  Top 0.203: C15.1 L1.1 34.99,16.42 U1.100
PI_5V_RX
  Top 0.203: U$1.3 40.13,48.26 35.81,48.26 35.05,47.5 35.05,44.96 33.53,43.43 29.72,43.43 29.1,44.05 U2.10
PI_5V_TX
  Top 0.203: U$1.4 41.66,44.7 42.93,45.97 42.93,47.5 41.66,48.77 35.56,48.77 34.54,47.75 34.54,45.21 33.27,43.94 29.97,43.94 29.21,44.7 U2.11
PI_RX  (via drill 0.51)
  Top 0.203: PI.10 13.97,52.07 v13.97,49.53 | v12.45,45.21 12.95,45.21 16,42.16 19.81,42.16 20.83,43.18 20.83,43.69 21.19,44.05 U2.5
  Bottom 0.203: v13.97,49.53 13.97,46.74 v12.45,45.21
PI_SCL
  Top 0.203: PI.5 9.91,48.51 17.02,48.51 19.05,46.48 R3.1 19.25,45.35 U2.3
PI_SDA  (via drill 0.51)
  Top 0.203: PI.3 8.13,47.75 13.46,47.75 15.66,45.55 15.75,45.55 | 15.75,45.55 R2.1 17.02,45.72 | v20.83,46.23 21.05,46 U2.2 | v15.49,45.72 15.75,45.55
  Bottom 0.203: v15.49,45.72 20.32,45.72 v20.83,46.23
PI_TX  (via drill 0.51)
  Top 0.203: PI.8 11.43,52.07 v11.43,49.53 | v11.43,46.48 12.45,46.48 16.26,42.67 19.56,42.67 20.32,43.43 20.32,44.2 20.83,44.7 U2.4
  Bottom 0.203: v11.43,49.53 v11.43,46.48
RST  (via drill 0.51)
  Top 0.203: U1.30 19.3,29.28 19.3,30.73 20.83,32.26 29.46,32.26 v29.97,32.77 | C1.1 R1.1 C2.1 | C1.1 81.62,16.76 77.98,16.76 77.47,16.26 77.47,10.67 76.71,9.91 62.74,9.91 61.72,10.92 61.72,21.08 60.96,21.84 51.82,21.84 v51.56,21.59 51.56,13.72 J1.5 | S1.B2 83.78,16.63 C1.1
  Bottom 0.203: v29.97,32.77 30.23,32.51 30.23,31.5 36.83,24.89 36.83,22.35 38.35,20.83 40.64,20.83 41.66,21.84 51.31,21.84 v51.56,21.59
RX0  (via drill 0.51)
  Top 0.203: U1.2 33.43,22.35 39.12,22.35 v39.88,21.59 49.53,21.59 50.29,22.35 61.72,22.35 64.01,20.07 64.01,11.43 64.52,10.92 66.8,10.92 67.82,11.94 JP1.3 | U$1.2 37.59,37.59 v34.04,37.59
  Bottom 0.203: v39.88,21.59 38.35,21.59 37.34,22.61 37.34,25.15 30.73,31.75 30.73,34.29 v34.04,37.59
RX1  (via drill 0.51)
  Top 0.203: U1.45 12.32,25.65 v11.18,25.65 | v33.27,42.16 37.08,42.16 U$1.6
  Bottom 0.203: v11.18,25.65 11.94,26.42 11.94,28.96 11.43,29.46 11.43,40.39 13.46,42.42 27.94,42.42 28.19,42.16 v33.27,42.16
RX3  (via drill 0.51)
  Top 0.203: U1.63 16.51,13.21 v16.51,12.19
  Bottom 0.203: v16.51,12.19 16.51,12.7 11.43,17.78 11.43,23.11 12.95,24.64 12.95,29.46 12.45,29.97 12.45,39.88 13.97,41.4 27.43,41.4 28.45,40.39 32.77,40.39 U$1.8
SCK  (via drill 0.51)
  Top 0.203: U1.20 27.94,29.59 v27.94,30.99
  Bottom 0.203: v27.94,30.99 27.94,29.46 35.05,22.35 35.05,20.57 35.31,20.32 49.53,20.32 51.56,18.29 51.56,16.26 J1.3
SERVO1
  Top 0.203: SRV.1 12.19,42.16 12.19,32.85 U1.35
SERVO2
  Top 0.203: SRV.2 11.68,40.13 11.68,32.66 U1.36
SERVO3
  Top 0.203: U1.37 11.18,32.46 11.18,38.1 SRV.3
SERVO4
  Top 0.203: U1.38 10.67,32.26 10.67,36.07 SRV.4
SERVO5
  Top 0.203: U1.39 10.16,32.06 10.16,34.04 SRV.5
SERVO6
  Top 0.203: U1.40 8.64,32.88 SRV.6
SERVO7
  Top 0.203: U1.41 10.32,30.48 SRV.7
SERVO8
  Top 0.203: U1.42 10.89,29.21 9.91,29.21 SRV.8
SERVO9
  Top 0.203: U1.47 13.21,23.35 13.21,23.37 10.67,23.37 SRV.9
SERVO10
  Top 0.203: U1.48 12.99,22.86 SRV.10
SERVO11
  Top 0.203: U1.49 12.8,22.35 10.67,22.35 SRV.11
SERVO12
  Top 0.203: U1.50 9.77,17.78 SRV.12
TX0  (via drill 0.51)
  Top 0.203: U1.3 33.23,22.86 40.39,22.86 v40.89,22.35 49.53,22.35 50.04,22.86 61.98,22.86 65.28,19.56 JP1.2 | U$1.1 44.2,46.23 42.93,44.96 42.93,43.69 37.59,38.35 v36.07,38.35
  Bottom 0.203: v40.89,22.35 38.35,22.35 37.85,22.86 37.85,25.4 31.24,32 31.24,33.53 v36.07,38.35
TX1  (via drill 0.51)
  Top 0.203: U1.46 12.88,24.38 v11.43,24.38 | v32.26,41.15 38.1,41.15 40.39,43.43 40.39,45.47 U$1.5
  Bottom 0.203: v11.43,24.38 12.45,25.4 12.45,29.21 11.94,29.72 11.94,40.13 13.72,41.91 27.69,41.91 28.45,41.15 v32.26,41.15
TX3  (via drill 0.51)
  Top 0.203: U1.64 17.02,13.01 17.02,12.95 17.78,12.19 v17.78,11.68
  Bottom 0.203: v17.78,11.68 17.78,12.19 11.94,18.03 11.94,22.86 13.46,24.38 13.46,29.72 12.95,30.23 12.95,39.62 14.22,40.89 27.18,40.89 28.19,39.88 34.29,39.88 37.85,43.43 37.85,45.47 U$1.7
V_BATT  (via drill 0.61)
  Top 0.61: D7.2 83.14,46.65 v82.55,47.24 | D8.2 78.32,46.91 v77.98,47.24 | D5.2 73.49,46.91 v73.15,47.24 | D6.2 68.66,46.91 v68.33,47.24 | D3.2 63.84,46.91 v63.5,47.24 | D4.2 59.01,46.91 v58.67,47.24 | D1.2 54.19,46.91 v53.85,47.24 | D2.2 49.36,46.91 v49.02,47.24 | U4.6 63.72,32.89 C8.1 63.33,34.2 v62.74,34.8 | U3.6 41.62,32.89 C6.1 41.49,33.44 v40.64,34.29
  Bottom 0.61: v62.74,34.8 61.98,35.56 61.98,41.4 62.74,42.16 62.74,47.24 | v40.64,34.29 40.64,38.35 42.93,40.64 43.94,40.64 49.02,45.72 v49.02,47.24
  Bottom 0.813: 80.01,51.05 80.01,49.53 | 80.01,52.58 80.01,51.05 | 80.01,51.05 78.49,51.05 | 80.01,51.05 80.26,51.05
  pour Bottom: 48.26,46.48 48.26,48.01 76.2,48.01 77.98,49.78 77.98,52.32 78.74,53.09 80.52,53.09 81.28,52.32 81.28,49.78 83.31,47.75 83.31,46.48
XTAL1
  Top 0.203: U1.34 16.17,29.59 C10.1 16.17,38.27 Y1.2
XTAL2
  Top 0.203: U1.33 16.76,29.7 16.76,32.77 17.27,33.27 21.17,33.27 C9.1 25.91,38.01 Y1.1

### Text on the board
tPlace: + 4 - | + 3 - | + 2 - | + 1 - | - BAT + | R4 | R5 | U2 | 1 | R2 | R3 | 2 | TX | TX | RX | TX | RX | RX | TX | RX | 3 | 3 | 1 | Pi | 0 | Y1 | 4 | 5 | SERVO | 16MHz | C6 | C8 | 6 | C10 | C9 | C13 | 7 | U1 | C5 | 8 | C14 | 9 | C7 | 10 | RoverPi | C2 | 11 | R1 | 12 | L1 | C3 | C1 | MISO | 5V | +SRV- | C15 | TX | RX | 5V | S1 | SCK | MOSI | RST | GND | C12 | C4 | C11 | ENC | ADC | 5V | 30 | 28 | 26 | 24 | 22 | 20 | 18 | 16 | 14 | 12 | 10 | 8 | 6 | 4 | 2 | 0 | RESET | GRN | BLK | GND | 31 | 29 | 27 | 25 | 23 | 21 | 19 | 17 | 15 | 13 | 11 | 9 | 7 | 5 | 3 | 1
bPlace: RoverPi | dbommarito.com/roverpi | Rev 0.3 | Mar 21, 2014